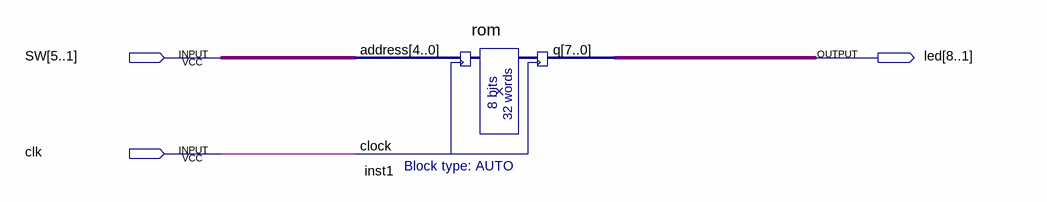
[diagram p0: schematic sheet]
// Quartus schematic memory.bdf as structural Verilog: 1 symbols, 3 pins
module memory (
  input  [5:1] SW,
  input  clk,
  output [8:1] led
);

  rom inst1 (.address(SW), .clock(clk), .q(led));
endmodule
